# EAGLE schematic PIC16_Blinky (EAGLE 9.1.3)
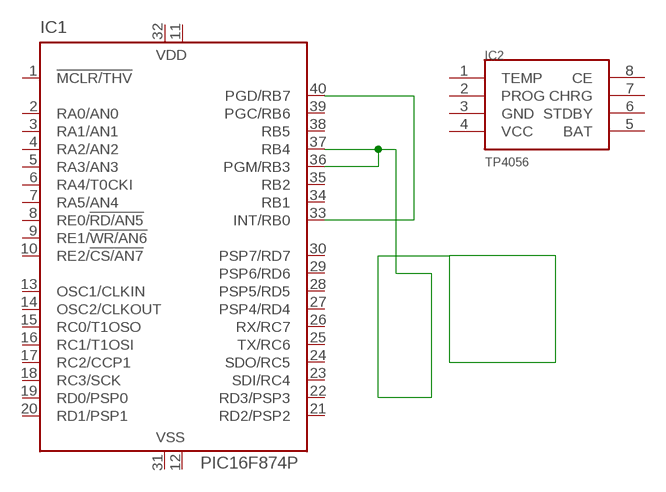
[diagram p0: schematic, sheet 1]

## Parts
IC1  PIC16F874P  [DIL40]
IC2  TP4056  [SOP-8]

## Nets
N$1: IC1.33(INT/RB0) IC1.40(PGD/RB7)
N$2: IC1.36(PGM/RB3) IC1.37(RB4)
Unconnected: IC1.1(!MCLR/THV) IC1.2(RA0/AN0) IC1.3(RA1/AN1) IC1.4(RA2/AN2) IC1.5(RA3/AN3) IC1.6(RA4/T0CKI) IC1.7(RA5/AN4) IC1.8(RE0/!RD/AN5) IC1.9(RE1/!WR/AN6) IC1.10(RE2/!CS/AN7) IC1.13(OSC1/CLKIN) IC1.14(OSC2/CLKOUT) IC1.15(RC0/T1OSO) IC1.16(RC1/T1OSI) IC1.17(RC2/CCP1) IC1.18(RC3/SCK) IC1.19(RD0/PSP0) IC1.20(RD1/PSP1) IC1.21(RD2/PSP2) IC1.22(RD3/PSP3) IC1.23(SDI/RC4) IC1.24(SDO/RC5) IC1.25(TX/RC6) IC1.26(RX/RC7) IC1.27(PSP4/RD4) IC1.28(PSP5/RD5) IC1.29(PSP6/RD6) IC1.30(PSP7/RD7) IC1.34(RB1) IC1.35(RB2) IC1.38(RB5) IC1.39(PGC/RB6) IC2.1(TEMP) IC2.2(PROG) IC2.3(GND) IC2.4(VCC) IC2.5(BAT) IC2.6(STDBY) IC2.7(CHRG) IC2.8(CE)

## Power pins joined to a net without a drawn wire
VDD: IC1.11(VDD) IC1.32(VDD)
VSS: IC1.12(VSS) IC1.31(VSS)

## Library data of the parts
IC1 = microchip:PIC16F87*: MICROCONTROLLER; MPN: PIC16F874-04I/P; OC_FARNELL: 1196797; OC_NEWARK: 24M5903
IC2 = TP4056:TP4056